# EasyEDA Pro project BLEhound.epro, schematic blehound
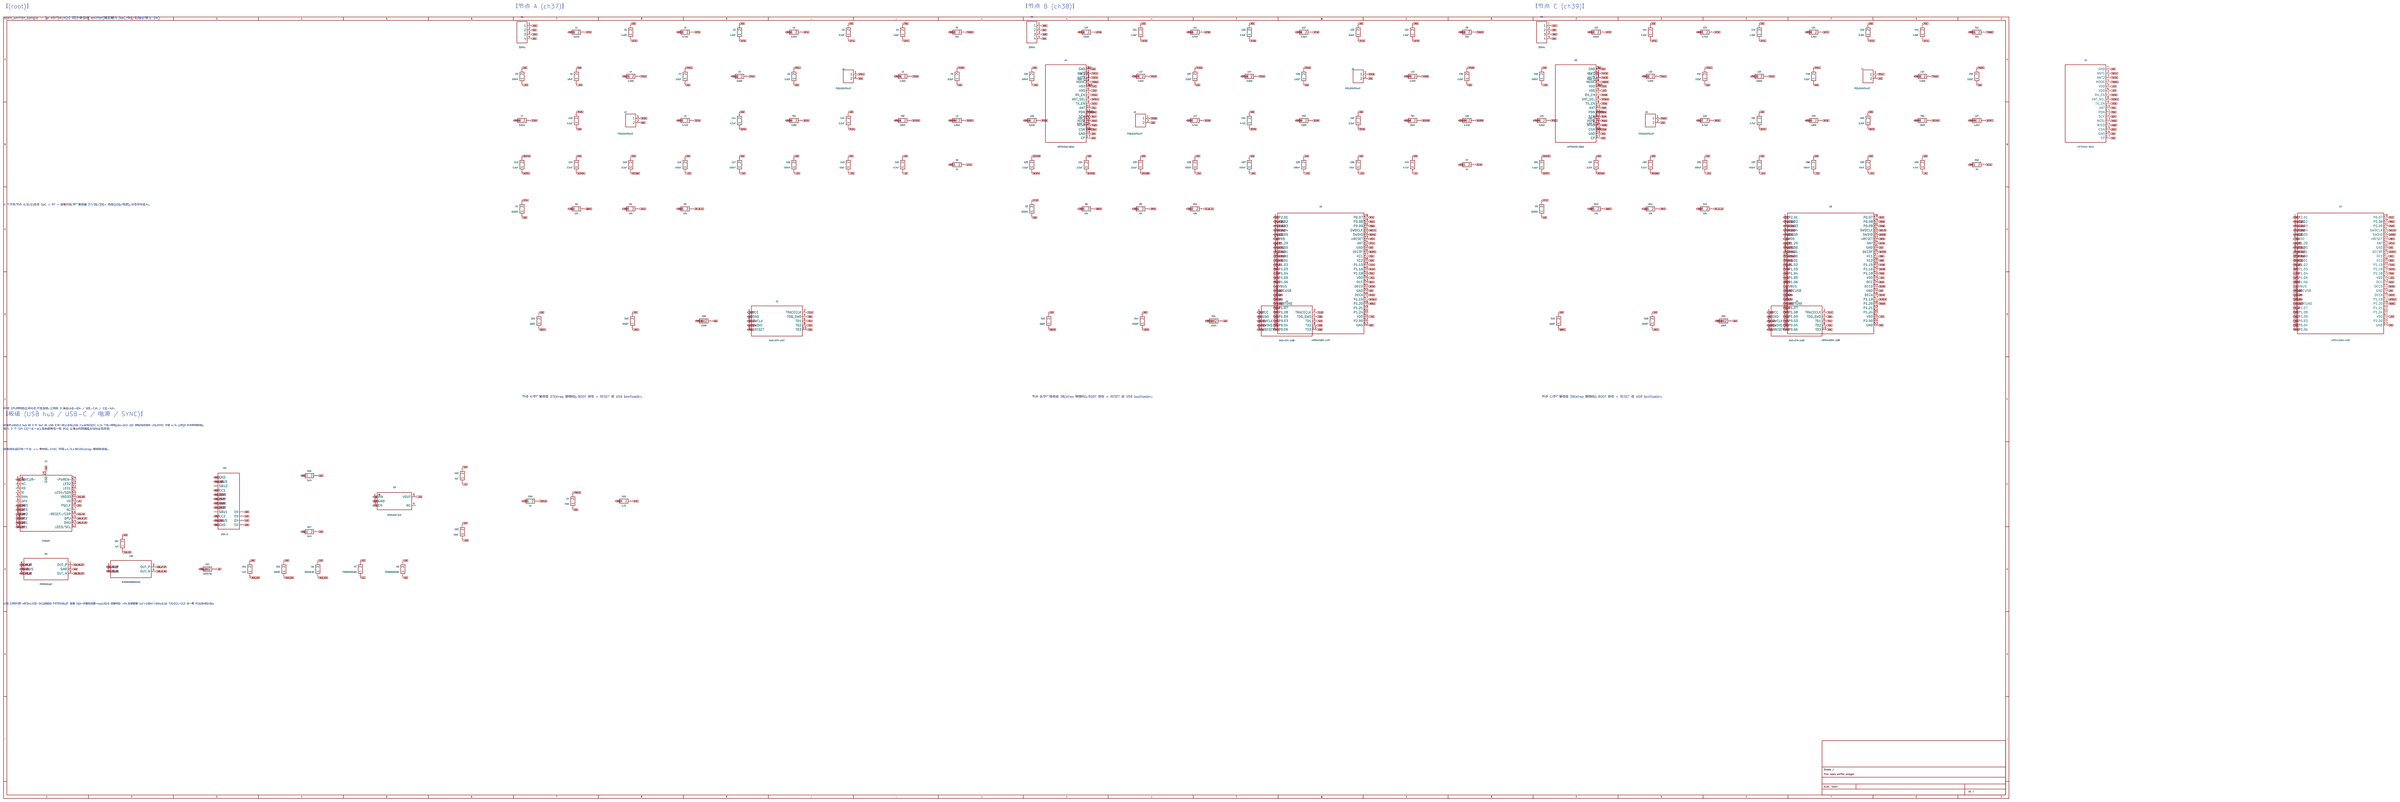
[diagram p0: schematic sheet]

## Parts
C1  1.2pF  [nRF54LM20A:DK_C_0201_0603Metric]
C2  1.5pF  [nRF54LM20A:DK_C_0201_0603Metric]
C3  0.3pF  [nRF54LM20A:DK_C_0201_0603Metric]
C4  1.0pF  [nRF54LM20A:DK_C_0201_0603Metric]
C5  100nF  [nRF54LM20A:DK_C_0201_0603Metric]
C6  10uF  [nRF54LM20A:DK_C_0402_1005Metric]
C7  2.0pF  [nRF54LM20A:DK_C_0201_0603Metric]
C8  1.0pF  [nRF54LM20A:DK_C_0201_0603Metric]
C9  2.0pF  [nRF54LM20A:DK_C_0201_0603Metric]
C10  1.0pF  [nRF54LM20A:DK_C_0201_0603Metric]
C11  4.7uF  [nRF54LM20A:DK_C_0201_0603Metric]
C12  2.2uF  [nRF54LM20A:DK_C_0201_0603Metric]
C13  1.0pF  [nRF54LM20A:DK_C_0201_0603Metric]
C14  2.2uF  [nRF54LM20A:DK_C_0201_0603Metric]
C15  2.2uF  [nRF54LM20A:DK_C_0201_0603Metric]
C16  100nF  [Capacitor_SMD:C_0402_1005Metric]
C17  100nF  [Capacitor_SMD:C_0402_1005Metric]
C18  100nF  [Capacitor_SMD:C_0402_1005Metric]
C19  10uF  [Capacitor_SMD:C_0603_1608Metric]
C20  4.7uF  [Capacitor_SMD:C_0603_1608Metric]
C21  1.2pF  [nRF54LM20A:DK_C_0201_0603Metric]
C22  1.5pF  [nRF54LM20A:DK_C_0201_0603Metric]
C23  0.3pF  [nRF54LM20A:DK_C_0201_0603Metric]
C24  1.0pF  [nRF54LM20A:DK_C_0201_0603Metric]
C25  100nF  [nRF54LM20A:DK_C_0201_0603Metric]
C26  10uF  [nRF54LM20A:DK_C_0402_1005Metric]
C27  2.0pF  [nRF54LM20A:DK_C_0201_0603Metric]
C28  1.0pF  [nRF54LM20A:DK_C_0201_0603Metric]
C29  2.0pF  [nRF54LM20A:DK_C_0201_0603Metric]
C30  1.0pF  [nRF54LM20A:DK_C_0201_0603Metric]
C31  4.7uF  [nRF54LM20A:DK_C_0201_0603Metric]
C32  2.2uF  [nRF54LM20A:DK_C_0201_0603Metric]
C33  1.0pF  [nRF54LM20A:DK_C_0201_0603Metric]
C34  2.2uF  [nRF54LM20A:DK_C_0201_0603Metric]
C35  2.2uF  [nRF54LM20A:DK_C_0201_0603Metric]
C36  100nF  [Capacitor_SMD:C_0402_1005Metric]
C37  100nF  [Capacitor_SMD:C_0402_1005Metric]
C38  100nF  [Capacitor_SMD:C_0402_1005Metric]
C39  10uF  [Capacitor_SMD:C_0603_1608Metric]
C40  4.7uF  [Capacitor_SMD:C_0603_1608Metric]
C41  1.2pF  [nRF54LM20A:DK_C_0201_0603Metric]
C42  1.5pF  [nRF54LM20A:DK_C_0201_0603Metric]
C43  0.3pF  [nRF54LM20A:DK_C_0201_0603Metric]
C44  1.0pF  [nRF54LM20A:DK_C_0201_0603Metric]
C45  100nF  [nRF54LM20A:DK_C_0201_0603Metric]
C46  10uF  [nRF54LM20A:DK_C_0402_1005Metric]
C47  2.0pF  [nRF54LM20A:DK_C_0201_0603Metric]
C48  1.0pF  [nRF54LM20A:DK_C_0201_0603Metric]
C49  2.0pF  [nRF54LM20A:DK_C_0201_0603Metric]
C50  1.0pF  [nRF54LM20A:DK_C_0201_0603Metric]
C51  4.7uF  [nRF54LM20A:DK_C_0201_0603Metric]
C52  2.2uF  [nRF54LM20A:DK_C_0201_0603Metric]
C53  1.0pF  [nRF54LM20A:DK_C_0201_0603Metric]
C54  2.2uF  [nRF54LM20A:DK_C_0201_0603Metric]
C55  2.2uF  [nRF54LM20A:DK_C_0201_0603Metric]
C56  100nF  [Capacitor_SMD:C_0402_1005Metric]
C57  100nF  [Capacitor_SMD:C_0402_1005Metric]
C58  100nF  [Capacitor_SMD:C_0402_1005Metric]
C59  10uF  [Capacitor_SMD:C_0603_1608Metric]
C60  4.7uF  [Capacitor_SMD:C_0603_1608Metric]
C61  1uF  [Capacitor_SMD:C_0402_1005Metric]
C62  1uF  [Capacitor_SMD:C_0603_1608Metric]
C63  10uF  [Capacitor_SMD:C_0603_1608Metric]
C64  1uF  [Capacitor_SMD:C_0603_1608Metric]
C65  100nF  [Capacitor_SMD:C_0402_1005Metric]
D1  GREEN  [LED_SMD:LED_0603_1608Metric]
D2  GREEN  [LED_SMD:LED_0603_1608Metric]
D3  GREEN  [LED_SMD:LED_0603_1608Metric]
D4  PWR  [LED_SMD:LED_0603_1608Metric]
D5  PRTR5V0U2F  [nordic:SON50P100X50-6N]
D6  SMAJ5.0A  [Diode_SMD:D_SMA]
D7  PESD5V0S1BA  [Diode_SMD:D_SOD-323]
D8  PESD5V0S1BA  [Diode_SMD:D_SOD-323]
FB1  120R  [nRF54LM20A:DK_L_0201_0603Metric]
FB2  15nH  [nRF54LM20A:DK_L_0201_0603Metric]
FB3  120R  [nRF54LM20A:DK_L_0201_0603Metric]
FB4  15nH  [nRF54LM20A:DK_L_0201_0603Metric]
FB5  120R  [nRF54LM20A:DK_L_0201_0603Metric]
FB6  15nH  [nRF54LM20A:DK_L_0201_0603Metric]
FB7  120R/3A  [nordic:INDC1608X06L]
J1  PCB.SMAFRA.HT  [nordic:SMA_RA_TH_Taoglas]
J2  PCB.SMAFRA.HT  [nordic:SMA_RA_TH_Taoglas]
J3  SWD+ETM ch37  [Connector_PinHeader_2.54mm:PinHeader_2x05_P2.54mm_Vertical]
J4  PCB.SMAFRA.HT  [nordic:SMA_RA_TH_Taoglas]
J5  PCB.SMAFRA.HT  [nordic:SMA_RA_TH_Taoglas]
J6  SWD+ETM ch38  [Connector_PinHeader_2.54mm:PinHeader_2x05_P2.54mm_Vertical]
J7  PCB.SMAFRA.HT  [nordic:SMA_RA_TH_Taoglas]
J8  PCB.SMAFRA.HT  [nordic:SMA_RA_TH_Taoglas]
J9  SWD+ETM ch39  [Connector_PinHeader_2.54mm:PinHeader_2x05_P2.54mm_Vertical]
J10  USB-C  [ext:USB-C_SMD-TYPE-C-31-M-12_1]
L1  3.6nH  [nRF54LM20A:DK_L_0201_0603Metric]
L2  4.7nH  [nRF54LM20A:DK_L_0201_0603Metric]
L3  3.3nH  [nRF54LM20A:DK_L_0201_0603Metric]
L4  1.9nH  [nRF54LM20A:DK_L_0201_0603Metric]
L5  3.0nH  [nRF54LM20A:DK_L_0201_0603Metric]
L6  1.9nH  [nRF54LM20A:DK_L_0201_0603Metric]
L7  3.0nH  [nRF54LM20A:DK_L_0201_0603Metric]
L8  4.7uH  [nRF54LM20A:DK_L_0603_1608Metric]
L9  1.0nH  [nRF54LM20A:DK_L_0201_0603Metric]
L10  3.6nH  [nRF54LM20A:DK_L_0201_0603Metric]
L11  4.7nH  [nRF54LM20A:DK_L_0201_0603Metric]
L12  3.3nH  [nRF54LM20A:DK_L_0201_0603Metric]
L13  1.9nH  [nRF54LM20A:DK_L_0201_0603Metric]
L14  3.0nH  [nRF54LM20A:DK_L_0201_0603Metric]
L15  1.9nH  [nRF54LM20A:DK_L_0201_0603Metric]
L16  3.0nH  [nRF54LM20A:DK_L_0201_0603Metric]
L17  4.7uH  [nRF54LM20A:DK_L_0603_1608Metric]
L18  1.0nH  [nRF54LM20A:DK_L_0201_0603Metric]
L19  3.6nH  [nRF54LM20A:DK_L_0201_0603Metric]
L20  4.7nH  [nRF54LM20A:DK_L_0201_0603Metric]
L21  3.3nH  [nRF54LM20A:DK_L_0201_0603Metric]
L22  1.9nH  [nRF54LM20A:DK_L_0201_0603Metric]
L23  3.0nH  [nRF54LM20A:DK_L_0201_0603Metric]
L24  1.9nH  [nRF54LM20A:DK_L_0201_0603Metric]
L25  3.0nH  [nRF54LM20A:DK_L_0201_0603Metric]
L26  4.7uH  [nRF54LM20A:DK_L_0603_1608Metric]
L27  1.0nH  [nRF54LM20A:DK_L_0201_0603Metric]
L28  DLM0NSM900HY2D  [nordic:CMC0806X05N]
R1  33k  [nRF54LM20A:DK_R_0201_0603Metric]
R2  1k  [Resistor_SMD:R_0402_1005Metric]
R3  10k  [Resistor_SMD:R_0402_1005Metric]
R4  10k  [Resistor_SMD:R_0402_1005Metric]
R5  10k  [Resistor_SMD:R_0402_1005Metric]
R6  33k  [nRF54LM20A:DK_R_0201_0603Metric]
R7  1k  [Resistor_SMD:R_0402_1005Metric]
R8  10k  [Resistor_SMD:R_0402_1005Metric]
R9  10k  [Resistor_SMD:R_0402_1005Metric]
R10  10k  [Resistor_SMD:R_0402_1005Metric]
R11  33k  [nRF54LM20A:DK_R_0201_0603Metric]
R12  1k  [Resistor_SMD:R_0402_1005Metric]
R13  10k  [Resistor_SMD:R_0402_1005Metric]
R14  10k  [Resistor_SMD:R_0402_1005Metric]
R15  10k  [Resistor_SMD:R_0402_1005Metric]
R16  5.1k  [Resistor_SMD:R_0402_1005Metric]
R17  5.1k  [Resistor_SMD:R_0402_1005Metric]
R18  1k  [Resistor_SMD:R_0402_1005Metric]
R19  4.7k  [Resistor_SMD:R_0402_1005Metric]
R20  200R  [Resistor_SMD:R_0402_1005Metric]
R21  200R  [Resistor_SMD:R_0402_1005Metric]
R22  200R  [Resistor_SMD:R_0402_1005Metric]
SW1  BOOT  [Button_Switch_SMD:SW_SPST_SKQG_WithoutStem]
SW2  RESET  [Button_Switch_SMD:SW_SPST_SKQG_WithoutStem]
SW3  BOOT  [Button_Switch_SMD:SW_SPST_SKQG_WithoutStem]
SW4  RESET  [Button_Switch_SMD:SW_SPST_SKQG_WithoutStem]
SW5  BOOT  [Button_Switch_SMD:SW_SPST_SKQG_WithoutStem]
SW6  RESET  [Button_Switch_SMD:SW_SPST_SKQG_WithoutStem]
U1  nRF54LM20A ch37  [nRF54LM20A:nRF54LM20A_QFN52_6x6mm_P0.4mm_EP4.7x4.7mm]
U2  nRF54LM20A ch38  [nRF54LM20A:nRF54LM20A_QFN52_6x6mm_P0.4mm_EP4.7x4.7mm]
U3  nRF54LM20A ch39  [nRF54LM20A:nRF54LM20A_QFN52_6x6mm_P0.4mm_EP4.7x4.7mm]
U4  nRF21540-QDAA  [nRF54LM20A:nRF21540_QFN16_4x4mm_P0.65mm_EP2.65]
U5  nRF21540-QDAA  [nRF54LM20A:nRF21540_QFN16_4x4mm_P0.65mm_EP2.65]
U6  nRF21540-QDAA  [nRF54LM20A:nRF21540_QFN16_4x4mm_P0.65mm_EP2.65]
U7  CH334F  [ext:QFN-24_L4.0-W4.0-P0.50-BL-EP2.8]
U8  AP2112K-3.3  [ext:SOT-25-5_L2.9-W1.6-P0.95-LS2.8-BL]
Y1  32MHz  [nRF54LM20A:DK_Crystal_32MHz]
Y2  32MHz  [nRF54LM20A:DK_Crystal_32MHz]
Y3  32MHz  [nRF54LM20A:DK_Crystal_32MHz]

## Library data of the parts
C1-C15 C21-C35 C41-C55 = osd_C
C16-C20 C36-C40 C56-C65 = osd_C: KiLib_Generator: SMD_2terminal_chip_molded
D1-D4 = osd_LED: KiLib_Generator: SMD_2terminal_chip_molded
D5 = osd_ESD_USB2
D6-D8 = osd_TVS
FB1-FB7 L1-L27 = osd_L
J1 J2 J4 J5 J7 J8 = osd_COAX_SMA_1: ID: $1I133
J3 J6 J9 = osd_DEBUG_ETM_HDR: KiLib_Generator: connector/pin_header_socket
J10 = osd_TYPE-C-31-M-12: LCSC Part: C165948
L28 = osd_CMC_2LINE
R1 R6 R11 = osd_R
R2-R5 R7-R10 R12-R22 = osd_R: KiLib_Generator: SMD_2terminal_chip_molded
SW1-SW6 = osd_SW
U1-U3 = osd_nRF54LM20A: KiLib_Generator: package/no_lead
U4-U6 = osd_NRF21540
U7 = osd_CH334F_C5187527: LCSC Part: C5187527
U8 = osd_AP2112K-3.3TRG1: LCSC Part: C51118
Y1-Y3 = osd_XTAL4

## Nets
+3V3: C5.1 C6.1 C16.1 C17.1 C18.1 C19.1 C25.1 C26.1 C36.1 C37.1 C38.1 C39.1 C45.1 C46.1 C56.1 C57.1 C58.1 C59.1 C63.1 J3.1(VCC) J6.1(VCC) J9.1(VCC) R3.1 R4.1 R5.1 R8.1 R9.1 R10.1 R13.1 R14.1 R15.1 R18.1 R19.1 U1.6(VDD) U1.14(P1.04) U1.42(VDD) U1.51(VDD) U2.6(VDD) U2.13(P1.03) U2.42(VDD) U2.51(VDD) U3.6(VDD) U3.14(P1.04) U3.42(VDD) U3.51(VDD) U4.5(VDD) U4.6(VDD) U5.5(VDD) U5.6(VDD) U6.5(VDD) U6.6(VDD) U8.5(VOUT)
+5V: C20.1 C40.1 C60.1 C62.1 FB7.2 U1.17(VBUS) U2.17(VBUS) U3.17(VBUS) U7.19(V5) U8.1(VIN) U8.3(EN)
GND: C1.2 C2.2 C3.2 C5.2 C6.2 C7.1 C8.1 C9.1 C10.1 C11.2 C12.2 C14.2 C15.2 C16.2 C17.2 C18.2 C19.2 C20.2 C21.2 C22.2 C23.2 C25.2 C26.2 C27.1 C28.1 C29.1 C30.1 C31.2 C32.2 C34.2 C35.2 C36.2 C37.2 C38.2 C39.2 C40.2 C41.2 C42.2 C43.2 C45.2 C46.2 C47.1 C48.1 C49.1 C50.1 C51.2 C52.2 C54.2 C55.2 C56.2 C57.2 C58.2 C59.2 C60.2 C61.2 C62.2 C63.2 C64.2 C65.2 D1.1 D2.1 D3.1 D4.1 D5.2(GND) D6.2 D7.2 D8.2 J1.2 J2.2 J3.3(GND) J4.2 J5.2 J6.3(GND) J7.2 J8.2 J9.3(GND) J10.1(EH) J10.2(EH) J10.3(EH) J10.4(EH) J10.A1B12(GND) J10.B1A12(GND) R16.2 R17.2 R20.2 R21.2 R22.2 SW1.2 SW2.2 SW3.2 SW4.2 SW5.2 SW6.2 U1.13(P1.03) U1.35(GND) U1.45(GND) U1.53(GND) U2.14(P1.04) U2.35(GND) U2.45(GND) U2.53(GND) U3.13(P1.03) U3.35(GND) U3.45(GND) U3.53(GND) U4.1(GND) U4.16(GND) U4.17(EP) U5.1(GND) U5.16(GND) U5.17(EP) U6.1(GND) U6.16(GND) U6.17(EP) U7.18(PSELF) U7.25(GND) U8.2(GND) Y1.2 Y1.4 Y2.2 Y2.4 Y3.2 Y3.4
VBUS_CON: C64.1 C65.1 D5.5(VBUS) D6.1 FB7.1 J10.A4B9(VBUS) J10.B4A9(VBUS)
ACTA: R2.1 U1.15(P1.05)
ACTB: R7.1 U2.15(P1.05)
ACTC: R12.1 U3.15(P1.05)
ACTnA: D1.2 R2.2
ACTnB: D2.2 R7.2
ACTnC: D3.2 R12.2
ANT1A: L1.1 U1.34(ANT)
ANT1B: L10.1 U2.34(ANT)
ANT1C: L19.1 U3.34(ANT)
ANT2A: C1.1 L1.2 L2.1
ANT2B: C21.1 L10.2 L11.1
ANT2C: C41.1 L19.2 L20.1
ANT3A: C2.1 L2.2 L3.1
ANT3B: C22.1 L11.2 L12.1
ANT3C: C42.1 L20.2 L21.1
ANT4A: C3.1 C4.1 L3.2
ANT4B: C23.1 C24.1 L12.2
ANT4C: C43.1 C44.1 L21.2
ANTSELA: U1.47(P1.19) U4.8(ANT_SEL)
ANTSELB: U2.47(P1.19) U5.8(ANT_SEL)
ANTSELC: U3.47(P1.19) U6.8(ANT_SEL)
BOOTA: R3.2 SW1.1 U1.16(P1.06)
BOOTB: R8.2 SW3.1 U2.16(P1.06)
BOOTC: R13.2 SW5.1 U3.16(P1.06)
CC1: D7.1 J10.A5(CC1) R16.1
CC2: D8.1 J10.B5(CC2) R17.1
CSNA: U1.27(P0.06) U4.15(CSN)
CSNB: U2.27(P0.06) U5.15(CSN)
CSNC: U3.27(P0.06) U6.15(CSN)
DCCA: L8.1 U1.43(DCC)
DCCB: L17.1 U2.43(DCC)
DCCC: L26.1 U3.43(DCC)
DECAA: C12.1 FB1.2 FB2.1 U1.46(DECA)
DECAB: C32.1 FB3.2 FB4.1 U2.46(DECA)
DECAC: C52.1 FB5.2 FB6.1 U3.46(DECA)
DECDA: C11.1 FB1.1 L8.2 U1.44(DECD)
DECDB: C31.1 FB3.1 L17.2 U2.44(DECD)
DECDC: C51.1 FB5.1 L26.2 U3.44(DECD)
DECMIDA: C13.2 C14.1 FB2.2 L9.1
DECMIDB: C33.2 C34.1 FB4.2 L18.1
DECMIDC: C53.2 C54.1 FB6.2 L27.1
DECRFA: C13.1 L9.2 U1.36(DECRF)
DECRFB: C33.1 L18.2 U2.36(DECRF)
DECRFC: C53.1 L27.2 U3.36(DECRF)
DECUSBA: C15.1 U1.18(DECUSB)
DECUSBB: C35.1 U2.18(DECUSB)
DECUSBC: C55.1 U3.18(DECUSB)
FANT1A: L4.1 U4.2(ANT1)
FANT1B: L13.1 U5.2(ANT1)
FANT1C: L22.1 U6.2(ANT1)
FANT2A: L6.1 U4.3(ANT2)
FANT2B: L15.1 U5.3(ANT2)
FANT2C: L24.1 U6.3(ANT2)
FMID1A: C7.2 L4.2 L5.1
FMID1B: C27.2 L13.2 L14.1
FMID1C: C47.2 L22.2 L23.1
FMID2A: C9.2 L6.2 L7.1
FMID2B: C29.2 L15.2 L16.1
FMID2C: C49.2 L24.2 L25.1
FMODEA: R1.2 U4.4(MODE)
FMODEB: R6.2 U5.4(MODE)
FMODEC: R11.2 U6.4(MODE)
HUB_V33: C61.1 U7.1(~OVCUR~) U7.16(~RESET~/CDP) U7.20(VDD33)
MISOA: U1.30(P0.09) U4.14(MISO)
MISOB: U2.30(P0.09) U5.14(MISO)
MISOC: U3.30(P0.09) U6.14(MISO)
MODEA: R1.1 U1.48(P1.20)
MODEB: R6.1 U2.48(P1.20)
MODEC: R11.1 U3.48(P1.20)
MOSIA: U1.29(P0.08) U4.13(MOSI)
MOSIB: U2.29(P0.08) U5.13(MOSI)
MOSIC: U3.29(P0.08) U6.13(MOSI)
nRSTA: J3.9(nRESET) R4.2 SW2.1 U1.33(nRESET)
nRSTB: J6.9(nRESET) R9.2 SW4.1 U2.33(nRESET)
nRSTC: J9.9(nRESET) R14.2 SW6.1 U3.33(nRESET)
PDNA: U1.41(P1.18) U4.11(PDN)
PDNB: U2.41(P1.18) U5.11(PDN)
PDNC: U3.41(P1.18) U6.11(PDN)
PWRLED: D4.2 R18.2
REQ_AB: U1.7(P1.29) U2.12(P1.02)
REQ_BC: U2.7(P1.29) U3.12(P1.02)
REQ_CA: U1.12(P1.02) U3.7(P1.29)
RFO1A: C8.2 J1.1 L5.2
RFO1B: C28.2 J4.1 L14.2
RFO1C: C48.2 J7.1 L23.2
RFO2A: C10.2 J2.1 L7.2
RFO2B: C30.2 J5.1 L16.2
RFO2C: C50.2 J8.1 L25.2
RXENA: U1.40(P1.16) U4.7(RX_EN)
RXENB: U2.40(P1.16) U5.7(RX_EN)
RXENC: U3.40(P1.16) U6.7(RX_EN)
SCKA: U1.28(P0.07) U4.12(SCK)
SCKB: U2.28(P0.07) U5.12(SCK)
SCKC: U3.28(P0.07) U6.12(SCK)
SPI_AB_CS: R5.2 U1.5(P2.05) U2.11(P1.01)
SPI_AB_MISO: U1.4(P2.04) U2.10(P1.00)
SPI_AB_MOSI: U1.3(P2.03) U2.9(P1.31)
SPI_AB_SCK: U1.2(P2.02) U2.8(P1.30)
SPI_BC_CS: R10.2 U2.5(P2.05) U3.11(P1.01)
SPI_BC_MISO: U2.4(P2.04) U3.10(P1.00)
SPI_BC_MOSI: U2.3(P2.03) U3.9(P1.31)
SPI_BC_SCK: U2.2(P2.02) U3.8(P1.30)
SPI_CA_CS: R15.2 U1.11(P1.01) U3.5(P2.05)
SPI_CA_MISO: U1.10(P1.00) U3.4(P2.04)
SPI_CA_MOSI: U1.9(P1.31) U3.3(P2.03)
SPI_CA_SCK: U1.8(P1.30) U3.2(P2.02)
SWCLKA: J3.5(SWCLK) U1.31(SWDCLK)
SWCLKB: J6.5(SWCLK) U2.31(SWDCLK)
SWCLKC: J9.5(SWCLK) U3.31(SWDCLK)
SWDIOA: J3.7(SWDIO) U1.32(SWDIO)
SWDIOB: J6.7(SWDIO) U2.32(SWDIO)
SWDIOC: J9.7(SWDIO) U3.32(SWDIO)
SYNC: R19.2 U1.1(P2.01) U2.1(P2.01) U3.1(P2.01)
TCLKA: J3.2(TRACECLK) U1.22(P1.07)
TCLKB: J6.2(TRACECLK) U2.22(P1.07)
TCLKC: J9.2(TRACECLK) U3.22(P1.07)
TD0A: J3.4(TD0_SWO) U1.23(P1.08)
TD0B: J6.4(TD0_SWO) U2.23(P1.08)
TD0C: J9.4(TD0_SWO) U3.23(P1.08)
TD1A: J3.6(TD1) U1.24(P1.09)
TD1B: J6.6(TD1) U2.24(P1.09)
TD1C: J9.6(TD1) U3.24(P1.09)
TD2A: J3.8(TD2) U1.25(P0.03)
TD2B: J6.8(TD2) U2.25(P0.03)
TD2C: J9.8(TD2) U3.25(P0.03)
TD3A: J3.10(TD3) U1.26(P0.04)
TD3B: J6.10(TD3) U2.26(P0.04)
TD3C: J9.10(TD3) U3.26(P0.04)
TRXA: C4.2 U4.10(ANT)
TRXB: C24.2 U5.10(ANT)
TRXC: C44.2 U6.10(ANT)
TXENA: U1.39(P1.15) U4.9(TX_EN)
TXENB: U2.39(P1.15) U5.9(TX_EN)
TXENC: U3.39(P1.15) U6.9(TX_EN)
TXRTUNEA: R20.1 U1.21(TXRTUNE)
TXRTUNEB: R21.1 U2.21(TXRTUNE)
TXRTUNEC: R22.1 U3.21(TXRTUNE)
USB_CON_DM: D5.4(IN_N) J10.A7(DN1) J10.B7(DN2)
USB_CON_DP: D5.6(IN_P) J10.A6(DP1) J10.B6(DP2)
USB_ESD_DM: D5.3(OUT_N) L28.1(IN_N)
USB_ESD_DP: D5.1(OUT_P) L28.2(IN_P)
USB_UP_DM: L28.4(OUT_N) U7.14(DMU)
USB_UP_DP: L28.3(OUT_P) U7.15(DPU)
USBA_DM: U1.20(D-) U7.11(DM1)
USBA_DP: U1.19(D+) U7.12(DP1)
USBB_DM: U2.20(D-) U7.9(DM2)
USBB_DP: U2.19(D+) U7.10(DP2)
USBC_DM: U3.20(D-) U7.7(DM3)
USBC_DP: U3.19(D+) U7.8(DP3)
XOA1: U1.37(XC1) Y1.1
XOA2: U1.38(XC2) Y1.3
XOB1: U2.37(XC1) Y2.1
XOB2: U2.38(XC2) Y2.3
XOC1: U3.37(XC1) Y3.1
XOC2: U3.38(XC2) Y3.3

Not connected (* = marked no-connect by the designer): J10 A8(SBU1) B8(SBU2); U1 49(P1.21) 50(P1.24) 52(P2.00); U2 49(P1.21) 50(P1.24) 52(P2.00); U3 49(P1.21) 50(P1.24) 52(P2.00); U7 2(NC.) 3(XO) 4(XI) 5(DM4) 6(DP4) 13(LED3/SCL) 17(NC) 21(LED4/SDA) 22(LED1) 23(LED2) 24(~PWREN~); U8 4(NC)

## Notes on the sheet
- 【(root)】
- 【节点 A (ch37)】
- 【节点 B (ch38)】
- 【节点 C (ch39)】
- open_sniffer_dongle — 3x nRF54LM20 同步多信道 sniffer(真实器件,SoC/RF/封装抄官方 DK)
- 4 个子页:节点 A/B/C(各含 SoC + RF + 板载天线,守广播信道 37/38/39)+ 板级(USB/电源)。双击方块进入。
- 节点 A:守广播信道 37(strap 硬编码)。BOOT 按住 + RESET 进 USB bootloader。
- 节点 B:守广播信道 38(strap 硬编码)。BOOT 按住 + RESET 进 USB bootloader。
- 节点 C:守广播信道 39(strap 硬编码)。BOOT 按住 + RESET 进 USB bootloader。
- 片间 SPI:两两独立点对点,不走总线。三角形 3 条边:A主-B从 / B主-C从 / C主-A从;
- 【板级 (USB hub / USB-C / 电源 / SYNC)】
- 板级页:USB2.0 hub 把 3 片 SoC 的 USB 汇成一路上主机;USB-C=主机口(CC 5.1k 下拉=受电);5V→3V3 LDO 供电;电源指示 LED;SYNC 开漏 4.7k 上拉(3 片共享同步线)。
- 每片 2 个 SPI 口(一主一从),每条链再加一根 REQ 让做从的那端能主动叫主机来读;
- 每条链永远只有一个主 => 零仲裁。SYNC 开漏+4.7k+共GND;strap 硬编码信道。
- USB 口保护(照 nRF54LM20-DK):数据线 PRTR5V0U2F 直通 ESD→共模扼流圈→hub;VBUS 经磁珠进 +5V,连接器侧 1uF+100nF+SMAJ5.0A TVS;CC1/CC2 各一颗 PESD5V0S1BA。
